# EAGLE design tpa6120Opt (EAGLE 6.4)
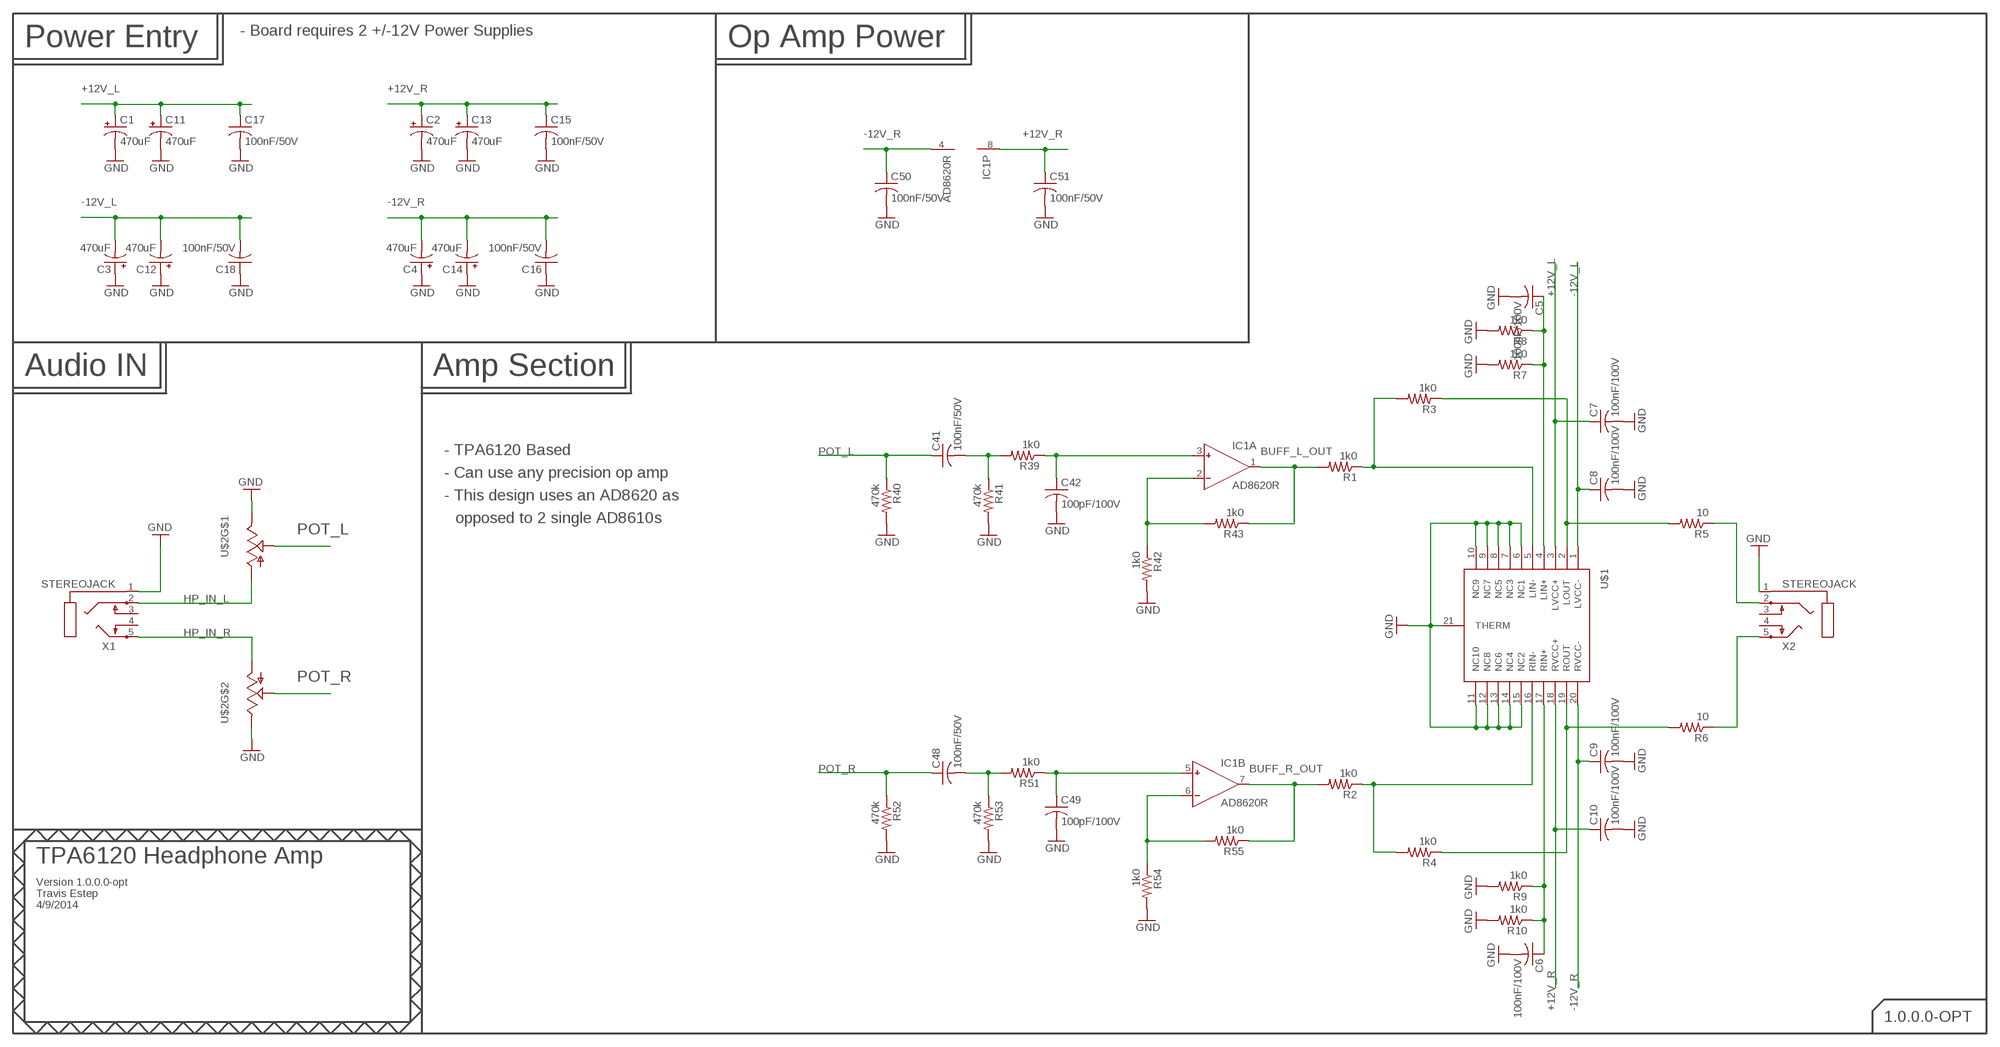
[diagram p0: schematic, sheet 1]

## Parts
C1  470uF  CPOL-USE5-13  [E5-13]
C2  470uF  CPOL-USE5-13  [E5-13]
C3  470uF  CPOL-USE5-13  [E5-13]
C4  470uF  CPOL-USE5-13  [E5-13]
C5  100nF/100V  C-USC0402  [C0402]
C6  100nF/100V  C-USC0402  [C0402]
C7  100nF/100V  C-USC0402  [C0402]
C8  100nF/100V  C-USC0402  [C0402]
C9  100nF/100V  C-USC0402  [C0402]
C10  100nF/100V  C-USC0402  [C0402]
C11  470uF  CPOL-USE5-13  [E5-13]
C12  470uF  CPOL-USE5-13  [E5-13]
C13  470uF  CPOL-USE5-13  [E5-13]
C14  470uF  CPOL-USE5-13  [E5-13]
C15  100nF/50V  C-USC0402K  [C0402K]
C16  100nF/50V  C-USC0402K  [C0402K]
C17  100nF/50V  C-USC0402K  [C0402K]
C18  100nF/50V  C-USC0402K  [C0402K]
C41  100nF/50V  C-USC0805  [C0805]
C42  100pF/100V  C-USC0805  [C0805]
C48  100nF/50V  C-USC0805  [C0805]
C49  100pF/100V  C-USC0805  [C0805]
C50  100nF/50V  C-USC0402K  [C0402K]
C51  100nF/50V  C-USC0402K  [C0402K]
IC1  AD8620R  [SO8]
R1  1k0  R-US_R0402  [R0402]
R2  1k0  R-US_R0402  [R0402]
R3  1k0  R-US_R0402  [R0402]
R4  1k0  R-US_R0402  [R0402]
R5  10  R-US_R0402  [R0402]
R6  10  R-US_R0402  [R0402]
R7  1k0  R-US_R0402  [R0402]
R8  1k0  R-US_R0402  [R0402]
R9  1k0  R-US_R0402  [R0402]
R10  1k0  R-US_R0402  [R0402]
R39  1k0  R-US_M0805  [M0805]
R40  470k  R-US_M0805  [M0805]
R41  470k  R-US_M0805  [M0805]
R42  1k0  R-US_M0805  [M0805]
R43  1k0  R-US_M0805  [M0805]
R51  1k0  R-US_M0805  [M0805]
R52  470k  R-US_M0805  [M0805]
R53  470k  R-US_M0805  [M0805]
R54  1k0  R-US_M0805  [M0805]
R55  1k0  R-US_M0805  [M0805]
U$1  TPA6120_TPA6120  [TPA6120_TPA6120]
U$2  ALPS_BLUE  [ALPS_RK27]
X1  STEREOJACK  [STX3100]
X2  STEREOJACK  [STX3100]

## Nets
+12V_L: C1.+ C7.1 C11.+ C17.1 U$1.3(LVCC+)
+12V_R: C2.+ C10.1 C13.+ C15.1 C51.1 IC1.8(P:V+) U$1.18(RVCC+)
-12V_L: C3.- C8.1 C12.- C18.2 U$1.1(LVCC-)
-12V_R: C4.- C9.1 C14.- C16.2 C50.1 IC1.4(P:V-) U$1.20(RVCC-)
BUFF_L_OUT: IC1.1(A:OUT) R1.2 R43.1
BUFF_R_OUT: IC1.7(B:OUT) R2.2 R55.1
GND: C1.- C2.- C3.+ C4.+ C5.2 C6.2 C7.2 C8.2 C9.2 C10.2 C11.- C12.+ C13.- C14.+ C15.2 C16.1 C17.2 C18.1 C42.2 C49.2 C50.2 C51.2 R7.2 R8.2 R9.2 R10.2 R40.2 R41.2 R42.2 R52.2 R53.2 R54.2 U$1.6(NC1) U$1.7(NC3) U$1.8(NC5) U$1.9(NC7) U$1.10(NC9) U$1.11(NC10) U$1.12(NC8) U$1.13(NC6) U$1.14(NC4) U$1.15(NC2) U$1.21(THERM) U$2.I1 U$2.I2 X1.1 X2.1
HP_IN_L: U$2.G1 X1.2
HP_IN_R: U$2.G2 X1.5
INVERT_L: R1.1 R3.2 U$1.5(LIN-)
INVERT_R: R2.1 R4.2 U$1.16(RIN-)
N$19: C5.1 R7.1 R8.1 U$1.4(LIN+)
N$20: C6.1 R9.1 R10.1 U$1.17(RIN+)
N$23: R6.1 X2.5
N$24: R5.1 X2.2
N$30: C41.2 R39.2 R41.1
N$31: C42.1 IC1.3(A:IN+) R39.1
N$32: IC1.2(A:IN-) R42.1 R43.2
N$39: C48.2 R51.2 R53.1
N$40: C49.1 IC1.5(B:IN+) R51.1
N$41: IC1.6(B:IN-) R54.1 R55.2
OUT_L: R3.1 R5.2 U$1.2(LOUT)
OUT_R: R4.1 R6.2 U$1.19(ROUT)
POT_L: C41.1 R40.1 U$2.O1
POT_R: C48.1 R52.1 U$2.O2
Unconnected: X1.3 X1.4 X2.3 X2.4

## Notes on the sheet
- - Board requires 2 +/-12V Power Supplies
- Power Entry | Op Amp Power
- Audio IN | Amp Section
- - TPA6120 Based
- - Can use any precision op amp
- - This design uses an AD8620 as
- opposed to 2 single AD8610s
- TPA6120 Headphone Amp
- Version 1.0.0.0-opt
- Travis Estep
- 4/9/2014
- 1.0.0.0-OPT

## Library data of the parts
C1-C4 C11-C14 = rcl:CPOL-US: POLARIZED CAPACITOR, American symbol
C5-C10 C15-C18 C41 C42 C48-C51 = rcl:C-US: CAPACITOR, American symbol
IC1 = analog-devices:AD8620: Precision, Very Low Noise, Low Input Bias Current, Wide Bandwidth JFET Operational Amplifiers Source: http://www.analog.com/static/imported-files/data_sheets/AD8610_8620.pdf; MF: ALTERA CORPORATION; MPN: AD8620ARZ; OC_FARNELL: 9994386; OC_NEWARK: 59K6972
R1-R10 R39-R43 R51-R55 = rcl:R-US_: RESISTOR, American symbol
U$1 = amp:TPA6120_TPA6120
U$2 = audio-pots:ALPS_BLUE: Alps Blue potentiometer
X1 X2 = adafruit:STEREOJACK: MIC/HEADPHONE JACK Stereo jack with two switches. Kycon STX3100, CUI SJ1-3555NG and/or 4UCon 05544

## Board
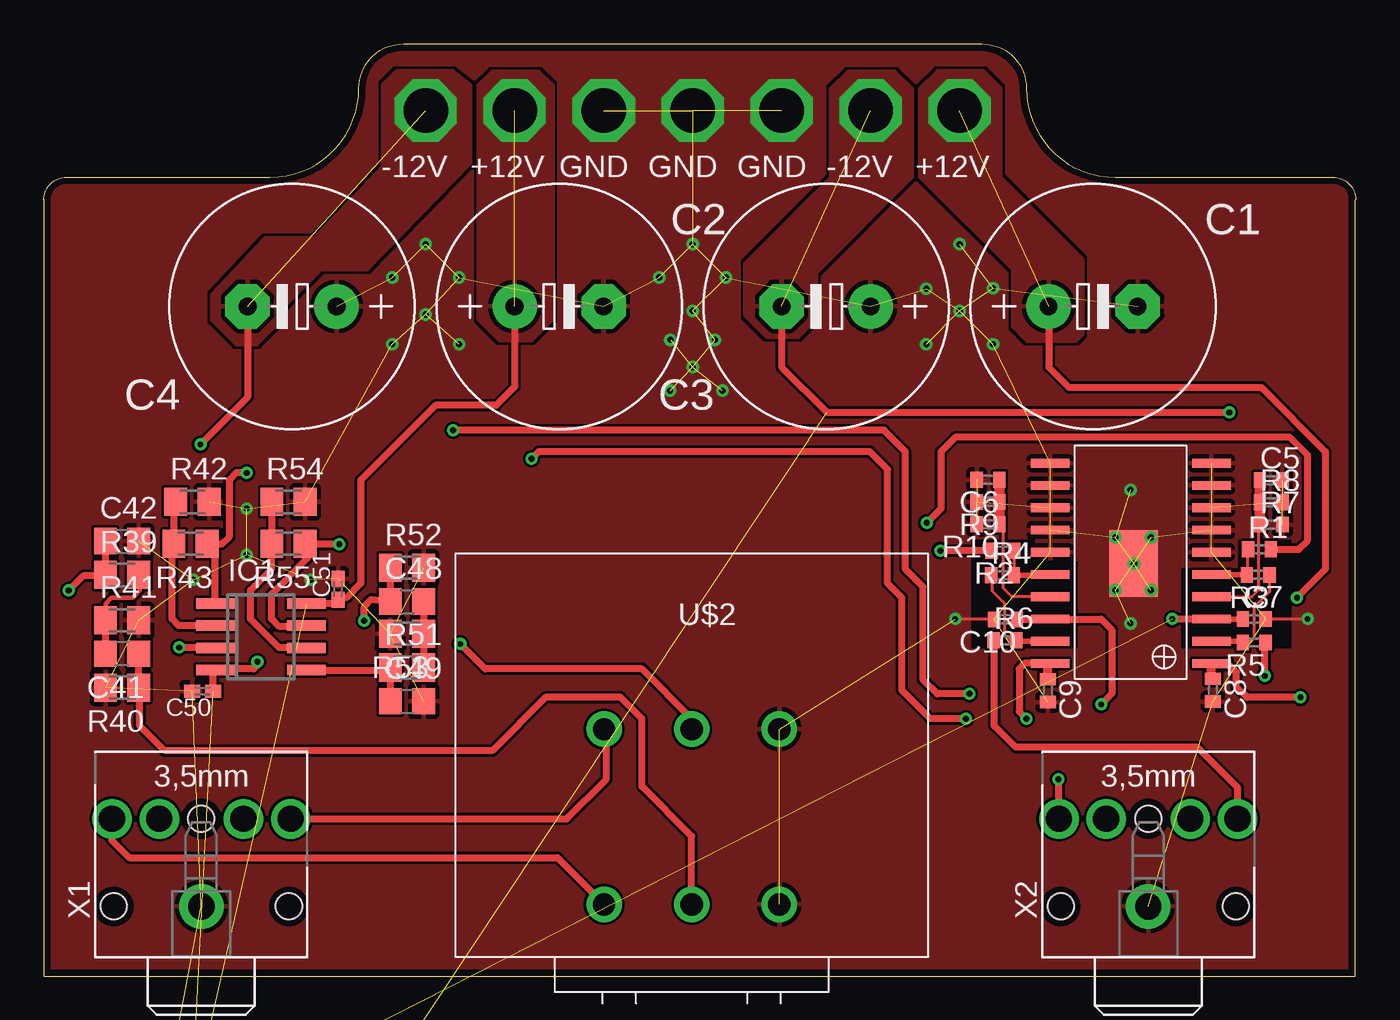
[diagram p1: board, top side]
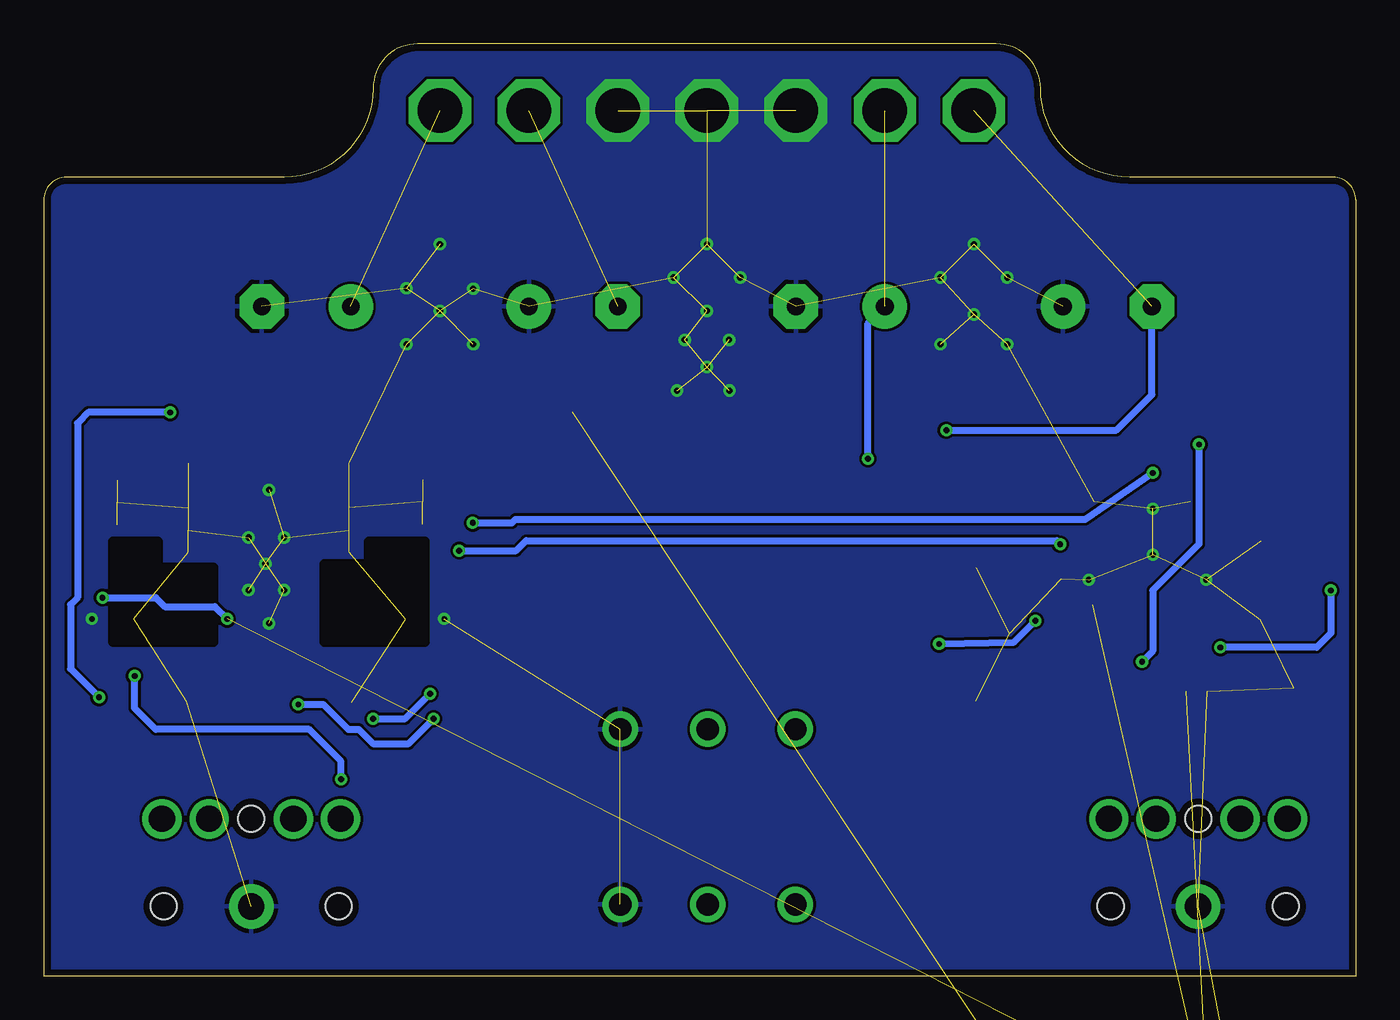
[diagram p2: board, bottom side, seen from below]

Size 74.88 x 53.19 mm. Coordinates in mm from the lower left corner, seen from the top.
Outline: 74.86,44.3 74.86,0 0,0 0,44.3 arc-90 1.27,45.57 12.9,45.57 arc90 17.98,50.65 arc-90 20.52,53.19 53.54,53.19 arc-90 56.08,50.65 arc90 61.16,45.57 73.61,45.57 arc-90 74.88,44.3
Copper layers (1*16): Top 0.0356mm / dielectric 1.5011mm / Bottom 0.0356mm
Design rules "LaenPCBOrder": minimum track width 6mil, minimum drill 13mil, track to track 6mil, track to pad 6mil, pad to pad 6mil, via to via 6mil, smd to smd 6mil, copper to edge 15mil, drill to drill 6mil, minimum pad ring 7mil, minimum via ring 7mil, stop-mask expansion 3mil, vias tented up to drill 0mil, thermal gap 10mil
tRestrict: area 65,18.7 to 71.1,24.8; area 53,18.7 to 58.9,24.8
bRestrict: area 65.2,19.1 to 70.9,24.8; area 53.1,19.1 to 58.9,24.8

### Footprints (pad centres in the part's own frame; a part is rotated, then mirrored left to right if it is on the bottom)
E5-13 = drill 1.016 pad 2.54: + -2.54,0 | drill 1.016 pad 2.54 octagon: - 2.54,0
C0402 = smd 0.7 x 0.9: 1 -0.65,0; 2 0.65,0
C0402K = smd 0.925 x 0.74: 1 -0.6,0; 2 0.6,0
C0805 = smd 1.3 x 1.5: 1 -0.95,0; 2 0.95,0
SO8 = smd 0.6 x 2.2: 1 -1.905,-2.6; 2 -0.635,-2.6; 3 0.635,-2.6; 4 1.905,-2.6; 5 1.905,2.6; 6 0.635,2.6; 7 -0.635,2.6; 8 -1.905,2.6
R0402 = smd 0.7 x 0.9: 1 -0.65,0; 2 0.65,0
M0805 = smd 1.3 x 1.6: 1 -0.95,0; 2 0.95,0
TPA6120_TPA6120 = smd 0.5 x 2.2: 1 0.25,1.095; 2 1.52,1.095; 3 2.79,1.095; 4 4.06,1.095; 5 5.33,1.095; 6 6.6,1.095; 7 7.87,1.095; 8 9.14,1.095; 9 10.41,1.095; 10 11.68,1.095; 11 11.68,10.295; 12 10.41,10.295; 13 9.14,10.295; 14 7.87,10.295; 15 6.6,10.295; 16 5.33,10.295; 17 4.06,10.295; 18 2.79,10.295; 19 1.52,10.295; 20 0.25,10.295 | smd 3.81 x 2.79: 21 5.965,5.54
ALPS_RK27 = drill 1.27 pad 2.032: G1 5,4.5; G2 5,-5.5; I1 -5,4.5; I2 -5,-5.5; O1 0,4.5; O2 0,-5.5
STX3100 = drill 1.5 pad 2.54: 1 2.7,-0.1 | drill 1.5: 2 7.7,5; 3 7.7,2.3; 4 7.7,-2.5; 5 7.7,-5.2 | hole 1.5: 2.7,4.9; 2.7,-5.1; 7.7,-0.1

### Placement (x,y rotation side)
C1  59.89,38.2 0 top
C2  29.41,38.2 0 top
C3  44.65,38.2 180 top
C4  14.17,38.2 180 top
C5  70.05,28.3 0 top
C6  53.9,28.32 180 top
C7  69.09,20.37 0 top
C8  66.73,16.31 270 top
C9  57.3,16.28 270 top
C10  54.89,20.35 180 top
C11  3.45,-11.94 0 top  (outside the outline)
C12  3.45,-26.16 0 top  (outside the outline)
C13  3.45,-40.39 0 top  (outside the outline)
C14  3.45,-54.61 0 top  (outside the outline)
C15  -2.44,-63.55 0 top  (outside the outline)
C16  -2.44,-67.41 0 top  (outside the outline)
C17  -2.44,-71.27 0 top  (outside the outline)
C18  -2.44,-75.13 0 top  (outside the outline)
C41  4.47,18.39 180 top
C42  4.47,24.82 0 top
C48  20.73,21.36 0 top
C49  20.73,15.67 0 top
C50  9.07,16.26 180 top
C51  16.79,22.07 90 top
IC1  12.4,19.35 270 top
R1  69.38,24.35 0 top
R2  54.75,24.27 180 top
R3  69.32,22.89 180 top
R4  54.72,22.87 0 top
R5  69.09,19.02 180 top
R6  54.86,19.15 0 top
R7  70.05,25.76 0 top
R8  70.05,27.03 0 top
R9  53.9,27.05 180 top
R10  53.9,25.78 180 top
R39  4.47,22.89 0 top
R40  4.47,16.46 180 top
R41  4.47,20.29 0 top
R42  8.48,27.05 0 top
R43  8.38,24.66 180 top
R51  20.73,17.6 0 top
R52  20.73,23.29 0 top
R53  20.73,19.53 180 top
R54  13.97,27.05 0 top
R55  13.97,24.66 180 top
U$1  67.74,17.58 90 top
U$2  36.98,8.59 180 top
X1  8.89,1.27 90 top
X2  62.94,1.27 90 top

### Tracks (layer width: path | path; a pad name or v marks a point on that pad's centre or on a via)
+12V_L  (via drill 0.33, 2.54)  (3 unrouted)
  Top 0.305: U$1.3 C7.1
  Top 0.406: C1.+ 57.35,34.75 58.52,33.58 69.49,33.58 73.15,29.92 73.15,23.22 v71.53,21.59 | v64.41,20.37 U$1.3
  Bottom 0.406: v71.53,21.59 68.48,21.59 67.97,21.08 65.13,21.08 v64.41,20.37
  other vias: 52.27,49.38
  pour Top (rank 5): 49.99,50.65 49.99,45.57 55.27,40.28 55.27,37.03 56.08,36.22 58.93,36.22 59.33,36.63 59.33,40.89 54.66,45.57 54.66,50.65 53.64,51.66 51,51.66
+12V_R  (via drill 0.33, 2.54)  (3 unrouted)
  Top 0.203: 15.65,21.18 15,21.18 IC1.8
  Top 0.305: U$1.18 55.56,20.37 C10.1
  Top 0.406: IC1.8 16.58,21.26 C51.1 16.91,21.59 17.27,21.59 18.08,22.4 18.08,28.3 22.35,32.56 25.81,32.56 26.87,33.63 C2.+ | 55.56,20.37 60.35,20.37 60.96,19.76 60.96,16.1 v60.35,15.49 | v52.63,14.68 50.6,14.68 48.97,16.31 48.97,21.59 48.16,22.4 48.16,28.91 47.14,29.92 28.25,29.92 v27.84,29.52
  Bottom 0.406: v60.35,15.49 58.93,15.49 57.51,14.07 56.9,14.07 56.08,13.26 54.05,13.26 v52.63,14.68 | v27.84,29.52 27.84,37.24 C2.+
  other vias: 26.87,49.38
  pour Top (rank 5): 24.79,37.44 24.79,50.85 25.6,51.66 28.24,51.66 29.06,50.85 29.06,37.44 27.84,36.22 26.01,36.22
-12V_L  (via drill 0.33, 2.54)  (3 unrouted)
  Top 0.406: C3.- 42.11,34.75 44.7,32.16 v67.67,32.16 | v71.73,15.9 68.68,15.9 68.07,16.51 68.07,17.32 67.67,17.73 66.74,17.73 U$1.1
  Top 0.508: C8.1 66.65,16.96 U$1.1
  Bottom 0.406: v67.67,32.16 72.34,32.16 72.95,31.55 72.95,21.59 73.36,21.18 73.36,17.53 v71.73,15.9
  other vias: 47.19,49.38
  pour Top (rank 5): 49.58,50.65 49.58,45.57 44.09,40.08 44.09,37.44 43.08,36.42 41.25,36.42 40.03,37.64 40.03,40.69 44.91,45.57 44.91,50.65 45.92,51.66 48.56,51.66
-12V_R  (via drill 0.33, 2.54)  (3 unrouted)
  Top 0.406: C50.1 9.67,17.32 IC1.4 9.87,17.53 11.99,17.53 12.19,17.73 v12.19,17.93 | C4.- 11.63,33.02 v8.94,30.33 | C9.1 57.3,17.83 55.98,17.83 55.68,17.53 55.68,15.09 v56.08,14.68 | v52.83,16.1 51,16.1 50.19,16.92 50.19,22.2 49.17,23.22 49.17,29.92 47.95,31.14 v23.37,31.14
  Top 0.508: C9.1 57.3,17.68 U$1.20
  Bottom 0.406: v8.94,30.33 8.94,24.64 11.58,22 11.58,18.54 v12.19,17.93 | v56.08,14.68 54.25,14.68 v52.83,16.1 | v23.37,31.14 13.67,31.14 11.63,33.17 C4.-
  other vias: 21.79,49.38
  pour Top (rank 5): 23.37,51.66 20.12,51.66 19.3,50.85 19.3,46.18 15.44,42.11 12.6,42.11 9.55,38.86 9.55,37.44 10.97,36.02 12.19,36.02 13.61,37.44 13.61,38.05 15.85,40.28 18.49,40.28 24.38,46.38 24.38,50.85
BUFF_L_OUT  (via drill 0.33)
  Top 0.406: IC1.1 9.8,24.2 R43.1 9.36,24.64 10.16,24.64 10.57,25.04 10.57,28.3 10.97,28.7 v11.58,28.7 | R1.2 71.64,24.35 72.14,24.84 72.14,29.72 71.12,30.73 52.02,30.73 51.21,29.92 51.21,26.67 v50.39,25.86
  Bottom 0.406: v50.39,25.86 48.16,25.86 47.95,26.06 15.44,26.06 v11.58,28.7
BUFF_R_OUT  (via drill 0.33)
  Top 0.406: IC1.7 14.97,19.96 13.41,19.96 13,20.37 13,21.79 15.04,23.83 15.04,24.55 R55.1 | R2.2 v51.17,24.27 | v16.87,24.64 14.95,24.64 R55.1 | 14.83,24.58 R55.1
  Bottom 0.406: v51.17,24.27 47.92,24.27 47.35,24.84 17.07,24.84 v16.87,24.64
GND  (via drill 0.33, 0.35, 2.54)  (81 unrouted)
  Top 0.178: C10.2 52.02,20.35 v52.02,20.37 | C7.2 v72.14,20.37
  other vias: 61.16,25.02 61.16,22.02 62.03,20.12 63.2,22.02 63.2,25.02 21.79,41.76 23.7,39.85 19.89,39.85 21.79,37.74 23.7,36.04 19.89,36.04 62.03,27.74 52.27,41.76 54.18,39.24 54.18,36.04 52.27,37.95 50.37,36.04 50.37,39.22 37.03,41.76 38.94,39.85 37.03,37.95 38.73,33.4 35.13,39.85 35.74,33.4 37.03,34.75 38.3,36.3 35.76,36.3 62.23,23.52 31.95,49.38 37.03,49.38 42.11,49.38 15.24,22.61 11.58,26.67 11.58,24.03 8.53,22.61
  pour Top (no thermals): 60.15,26.06 64.41,26.06 64.41,21.18 60.15,21.18
  pour Top (rank 6): 33.93,52.68 53.44,52.68 arc-90 55.68,50.44 arc90 60.96,45.16 73.56,45.16 arc-90 74.57,44.15 74.57,0.46 0.41,0.46 0.41,44.15 arc-90 1.42,45.16 13,45.16 arc90 18.29,50.44 arc-90 20.52,52.68
  pour Bottom (rank 6): 33.93,52.68 53.44,52.68 arc-90 55.68,50.44 arc90 60.96,45.16 73.56,45.16 arc-90 74.57,44.15 74.57,0.46 0.41,0.46 0.41,44.15 arc-90 1.42,45.16 13,45.16 arc90 18.29,50.44 arc-90 20.52,52.68
HP_IN_L
  Top 0.406: X1.2 3.89,7.74 4.88,6.76 29.31,6.76 U$2.G1
HP_IN_R
  Top 0.406: X1.5 29.85,8.97 32.11,11.23 32.11,13.96 U$2.G2
INVERT_L
  Top 0.178: R3.2 68.73,22.89 R1.1
  Top 0.305: 68.67,24.32 R1.1 | U$1.5 68.64,22.91 R3.2
INVERT_R
  Top 0.178: 57.41,22.87 U$1.16 | 55.37,24.21 R2.1 55.4,22.87 R4.2
  Top 0.305: 57.41,22.87 R4.2
N$19
  Top 0.178: U$1.4 68.96,21.64 69.36,22.03 69.36,25.71 R7.1
  Top 0.61: R7.1 R8.1 C5.1
N$20
  Top 0.178: U$1.17 55.26,21.64 54.77,22.12 54.77,25.55 R10.1
  Top 0.61: C6.1 R9.1 R10.1
N$23
  Top 0.406: X2.5 68.14,10.75 65.84,13.06 55.47,13.06 54.25,14.28 54.25,19.11 R6.1
N$24  (via drill 0.33)
  Top 0.406: X2.2 57.94,11.2 v57.91,11.23 | v69.7,17.12 69.7,18.98 R5.1
  Bottom 0.406: v57.91,11.23 57.91,12.24 59.74,14.07 68.48,14.07 69.7,15.29 v69.7,17.12
N$30
  Top 0.254: 3.52,20.4 3.52,21.25 3.86,21.59 5.08,21.59 5.49,22 5.49,22.23 5.78,22.53
  Top 0.406: C41.2 R41.1 3.52,20.4 | 5.78,22.53 R39.2
  Top 0.61: 3.5,20.18 R41.1
N$31  (via drill 0.33)
  Top 0.406: C42.1 R39.1 3.47,22.84 2.26,22.84 v1.42,22 | v7.72,18.75 9.77,18.75 IC1.3
  Bottom 0.406: v1.42,22 1.42,19.56 2.23,18.75 v7.72,18.75
N$32
  Top 0.406: IC1.2 7.7,19.99 7.31,20.37 7.31,24.55 R43.2 7.43,26.95 R42.1
N$39
  Top 0.406: C48.2 R53.1 R51.2
N$40
  Top 0.406: IC1.5 19.78,17.45 | R51.1 19.78,17.45 | 19.78,17.45 C49.1
N$41
  Top 0.406: IC1.6 14.97,18.75 13.41,18.75 11.8,20.36 11.8,22.01 13,23.22 13,24.65 R55.2 R54.1
OUT_L
  Top 0.178: R5.2 68.72,19.1 68.91,19.1 69.09,19.28 69.09,21.06 69.98,21.95 69.98,22.88 R3.1
  Top 0.305: 67.48,19.1 U$1.2 68.36,19.1 R5.2
OUT_R
  Top 0.178: R6.2 55.17,19.15 54.86,19.46 54.86,21.23 54.15,21.95 54.15,22.79 R4.1
  Top 0.305: U$1.19 55.57,19.1 R6.2
POT_L
  Top 0.406: R40.1 C41.1 | U$2.O1 36.98,7.98 34.14,10.82 34.14,14.68 32.92,15.9 28.65,15.9 25.6,12.85 6.91,12.85 5.49,14.28 5.49,16.39 R40.1 | 5.47,16.51 R40.1
POT_R  (via drill 0.33)
  Top 0.406: U$2.O2 36.98,14.68 34.14,17.53 25.2,17.53 v23.77,18.95 | 19.71,23.36 R52.1 C48.1 19.75,21.39 18.69,21.49 18.29,21.08 v18.29,20.27
  Bottom 0.406: v23.77,18.95 19.51,19.05 v18.29,20.27

### Text on the board
tPlace: -12V | +12V | GND | GND | GND | -12V | +12V